# EAGLE design lcd_thermistor_two (EAGLE 6.0)
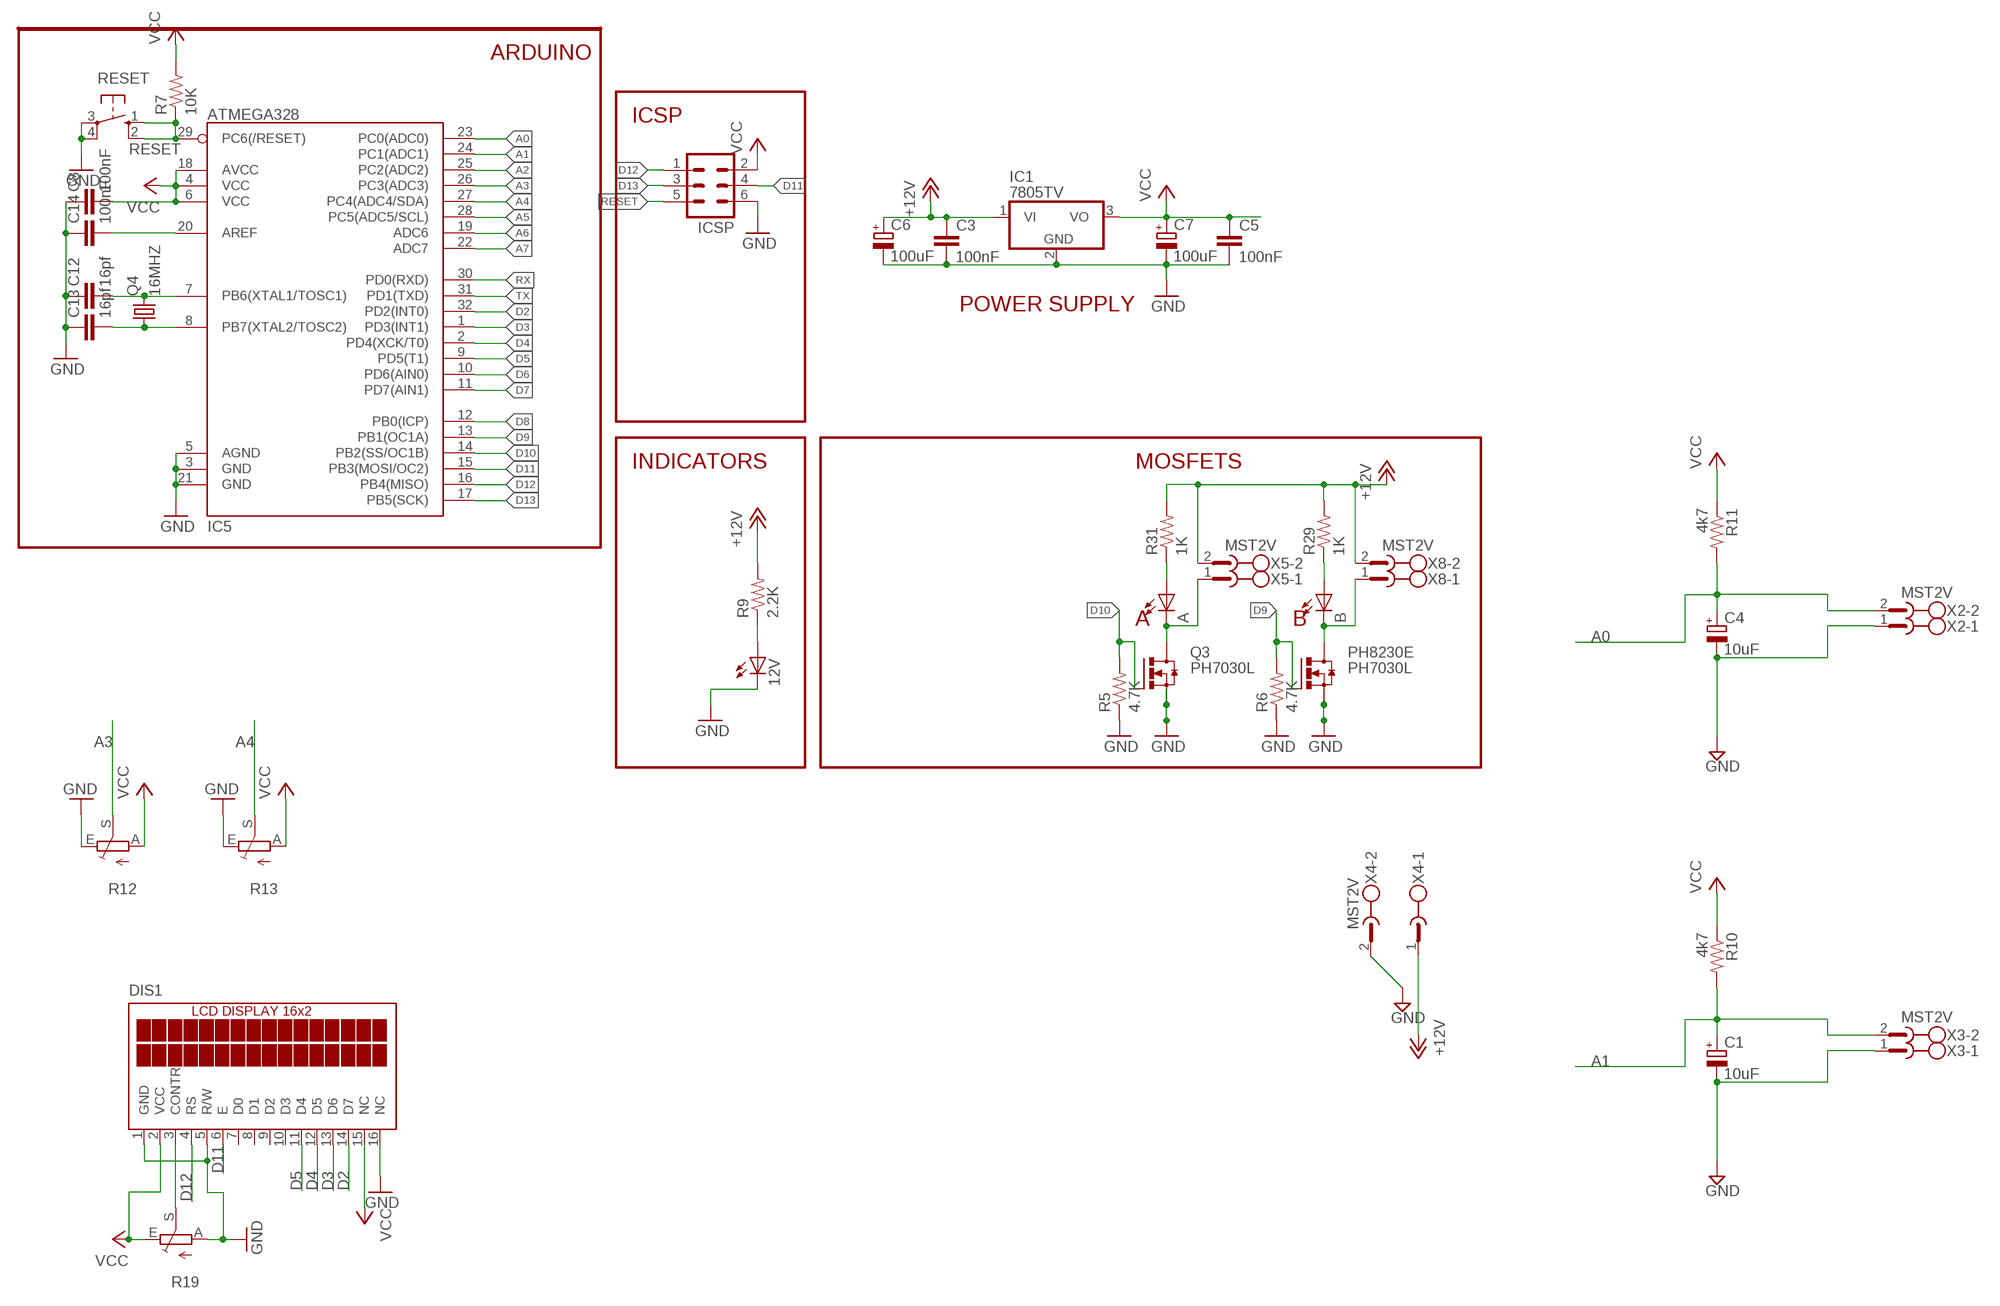
[diagram p0: schematic, sheet 1]

## Parts
12V  LED0805  [LED-0805]
A  LED0805  [LED-0805]
B  LED0805  [LED-0805]
C1  10uF  CPOL-EUE5-6  [E5-6]
C3  100nF  CAP0805  [0805]
C4  10uF  CPOL-EUE5-6  [E5-6]
C5  100nF  CAP0805  [0805]
C6  100uF  CPOL-EUE3.5-8  [E3,5-8]
C7  100uF  CPOL-EUE3.5-8  [E3,5-8]
C8  100nF  CAP0805  [0805]
C12  16pf  CAP0805  [0805]
C13  16pf  CAP0805  [0805]
C14  100nF  CAP0805  [0805]
DIS1  TUXGR_16X2_R2  [TUXGR_16X2_R2]
IC1  7805TV  [TO220V]
IC5  ATMEGA328  ATMEGA168  [TQFP32-08]
ICSP  ML6  [ML6]
PH8230E  PH7030L  [SOT669]
Q3  PH7030L  [SOT669]
Q4  16MHZ  CRYSTALHC49S  [HC49/S]
R5  4.7K  RESISTOR  [0805]
R6  4.7K  RESISTOR  [0805]
R7  10K  RESISTOR  [0805]
R9  2.2K  RESISTOR  [0805]
R10  4k7  RESISTOR  [0805]
R11  4k7  RESISTOR  [0805]
R12  TRIM_EU-B25U  [B25U]
R13  TRIM_EU-B25U  [B25U]
R19  TRIM_EU-B25P  [B25P]
R29  1K  RESISTOR  [0805]
R31  1K  RESISTOR  [0805]
RESET  10-XX  [B3F-10XX]
X2  MST2V  [MSTBV2]
X3  MST2V  [MSTBV2]
X4  MST2V  [MSTBV2]
X5  MST2V  [MSTBV2]
X8  MST2V  [MSTBV2]

## Nets
+12V [motors]: C3.1 C6.+ IC1.1(VI) R9.2 R29.2 R31.2 X4.1 X5.2 X8.2
A0: C4.+ IC5.23(PC0(ADC0)) R11.2 X2.2
A1: C1.+ IC5.24(PC1(ADC1)) R10.2 X3.2
A2: IC5.25(PC2(ADC2))
A3: IC5.26(PC3(ADC3)) R12.S
A4: IC5.27(PC4(ADC4/SDA)) R13.S
A5: IC5.28(PC5(ADC5/SCL))
A6: IC5.19(ADC6)
A7: IC5.22(ADC7)
APWR [motors]: A.C Q3.MB(D) X5.1
BPWR [motors]: B.C PH8230E.MB(D) X8.1
D2: DIS1.14(D7) IC5.32(PD2(INT0))
D3: DIS1.13(D6) IC5.1(PD3(INT1))
D4: DIS1.12(D5) IC5.2(PD4(XCK/T0))
D5: DIS1.11(D4) IC5.9(PD5(T1))
D6: IC5.10(PD6(AIN0))
D7: IC5.11(PD7(AIN1))
D8: IC5.12(PB0(ICP))
D9: IC5.13(PB1(OC1A)) PH8230E.4(G) R6.2
D10: IC5.14(PB2(SS/OC1B)) Q3.4(G) R5.2
D11: DIS1.6(E) IC5.15(PB3(MOSI/OC2)) ICSP.4
D12: DIS1.4(RS) IC5.16(PB4(MISO)) ICSP.1
D13: IC5.17(PB5(SCK)) ICSP.3
GND [motors]: 12V.C C1.- C3.2 C4.- C5.2 C6.- C7.- C8.1 C12.1 C13.1 C14.1 DIS1.1(GND) DIS1.5(R/W) DIS1.16(NC) IC1.2(GND) IC5.3(GND) IC5.5(AGND) IC5.21(GND) ICSP.6 PH8230E.1(S) PH8230E.2(S) PH8230E.3(S) Q3.1(S) Q3.2(S) Q3.3(S) R5.1 R6.1 R12.E R13.E R19.A RESET.3(P) RESET.4(P1) X2.1 X3.1 X4.2
N$20: C14.2 IC5.20(AREF)
N$26: 12V.A R9.1
N$29: DIS1.3(CONTR) R19.S
N$31: C12.2 IC5.7(PB6(XTAL1/TOSC1)) Q4.2
N$32: C13.2 IC5.8(PB7(XTAL2/TOSC2)) Q4.1
N$41: A.A R31.1
N$42: B.A R29.1
RESET: IC5.29(PC6(/RESET)) ICSP.5 R7.1 RESET.1(S) RESET.2(S1)
RX: IC5.30(PD0(RXD))
TX: IC5.31(PD1(TXD))
VCC: C5.1 C7.+ C8.2 DIS1.2(VCC) DIS1.15(NC) IC1.3(VO) IC5.4(VCC) IC5.6(VCC) IC5.18(AVCC) ICSP.2 R7.2 R10.1 R11.1 R12.A R13.A R19.E
Unconnected: DIS1.7(D0) DIS1.8(D1) DIS1.9(D2) DIS1.10(D3)

## Notes on the sheet
- ARDUINO
- ICSP
- POWER SUPPLY
- INDICATORS | MOSFETS
- A | B

## Library data of the parts
12V A B = SparkFun:LED: LEDs Standard schematic elements and footprints for 5mm, 3mm, 1206, and 0603 sized LEDs. 5mm - Spark Fun Electronics SKU : COM-00529 (and others)
C1 C4 C6 C7 = rcl:CPOL-EU: POLARIZED CAPACITOR, European symbol
C3 C5 C8 C12-C14 = SparkFun:CAP: Capacitor Standard 0603 ceramic capacitor, and 0.1" leaded capacitor.
DIS1 = display-lcd:TUXGR_16X2_R2: Tuxgraphics LCD display 16x2 characters reflective, without background light Source: tuxgr_12x2_r2.pdf
IC1 = linear:78*: Positive VOLTAGE REGULATOR Source: http://cache.national.com/ds/LM/LM78L05.pdf http://www.fairchildsemi.com/ds/LM/LM7805.pdf
IC5 = SparkFun:ATMEGA168
ICSP = con-harting-ml:ML6: HARTING
PH8230E Q3 = transistor-power:PH7030L: N-channel TrenchMOS (TM) logic level FET Source: http://www.nxp.com/acrobat_download/datasheets/PH7030L_4.pdf
Q4 = crystal:CRYSTAL: CRYSTAL
R5-R7 R9-R11 R29 R31 = SparkFun:RESISTOR: Resistor Basic schematic elements and footprints for 0603, 1206, and PTH 1/10th watt (small) resistors.
R12 R13 R19 = pot:TRIM_EU-: POTENTIOMETER
RESET = switch-omron:10-XX: OMRON SWITCH
X2-X5 X8 = con-phoenix-508:MST2V: PHOENIX

## Net classes
0 default: width 0.254 mm, clearance 0.254 mm
1 vcc: width 0.305 mm
2 motors: width 1.016 mm

## Board
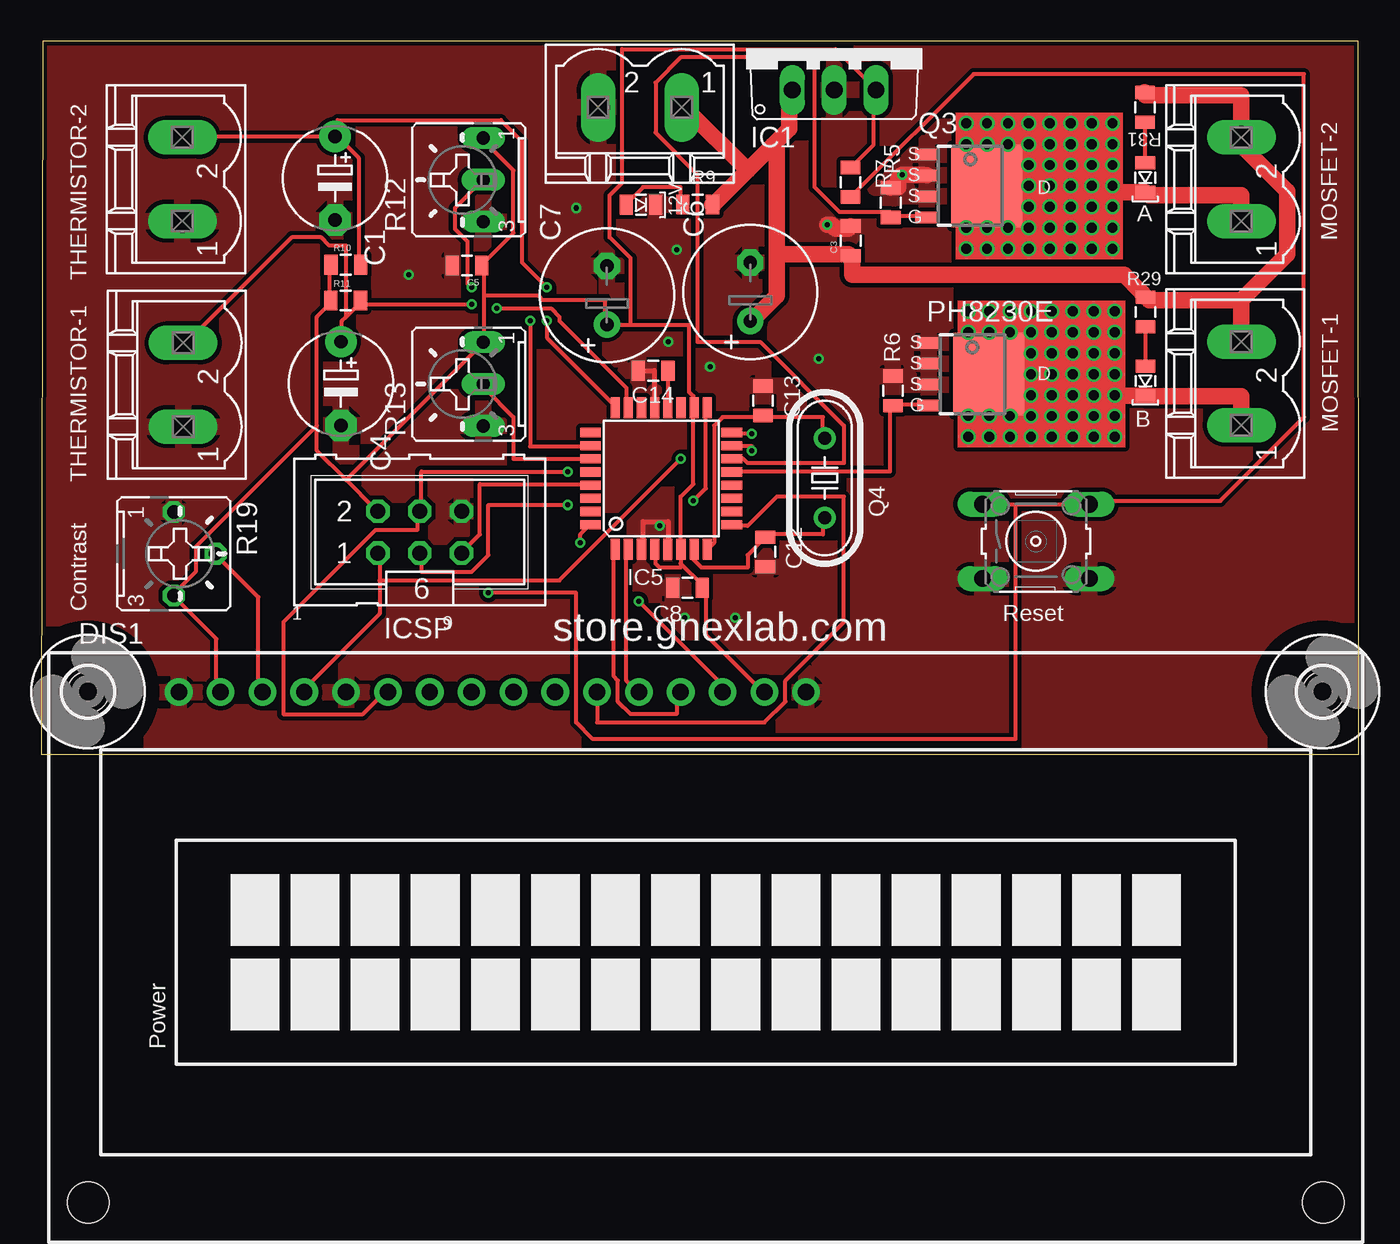
[diagram p1: board, top side]
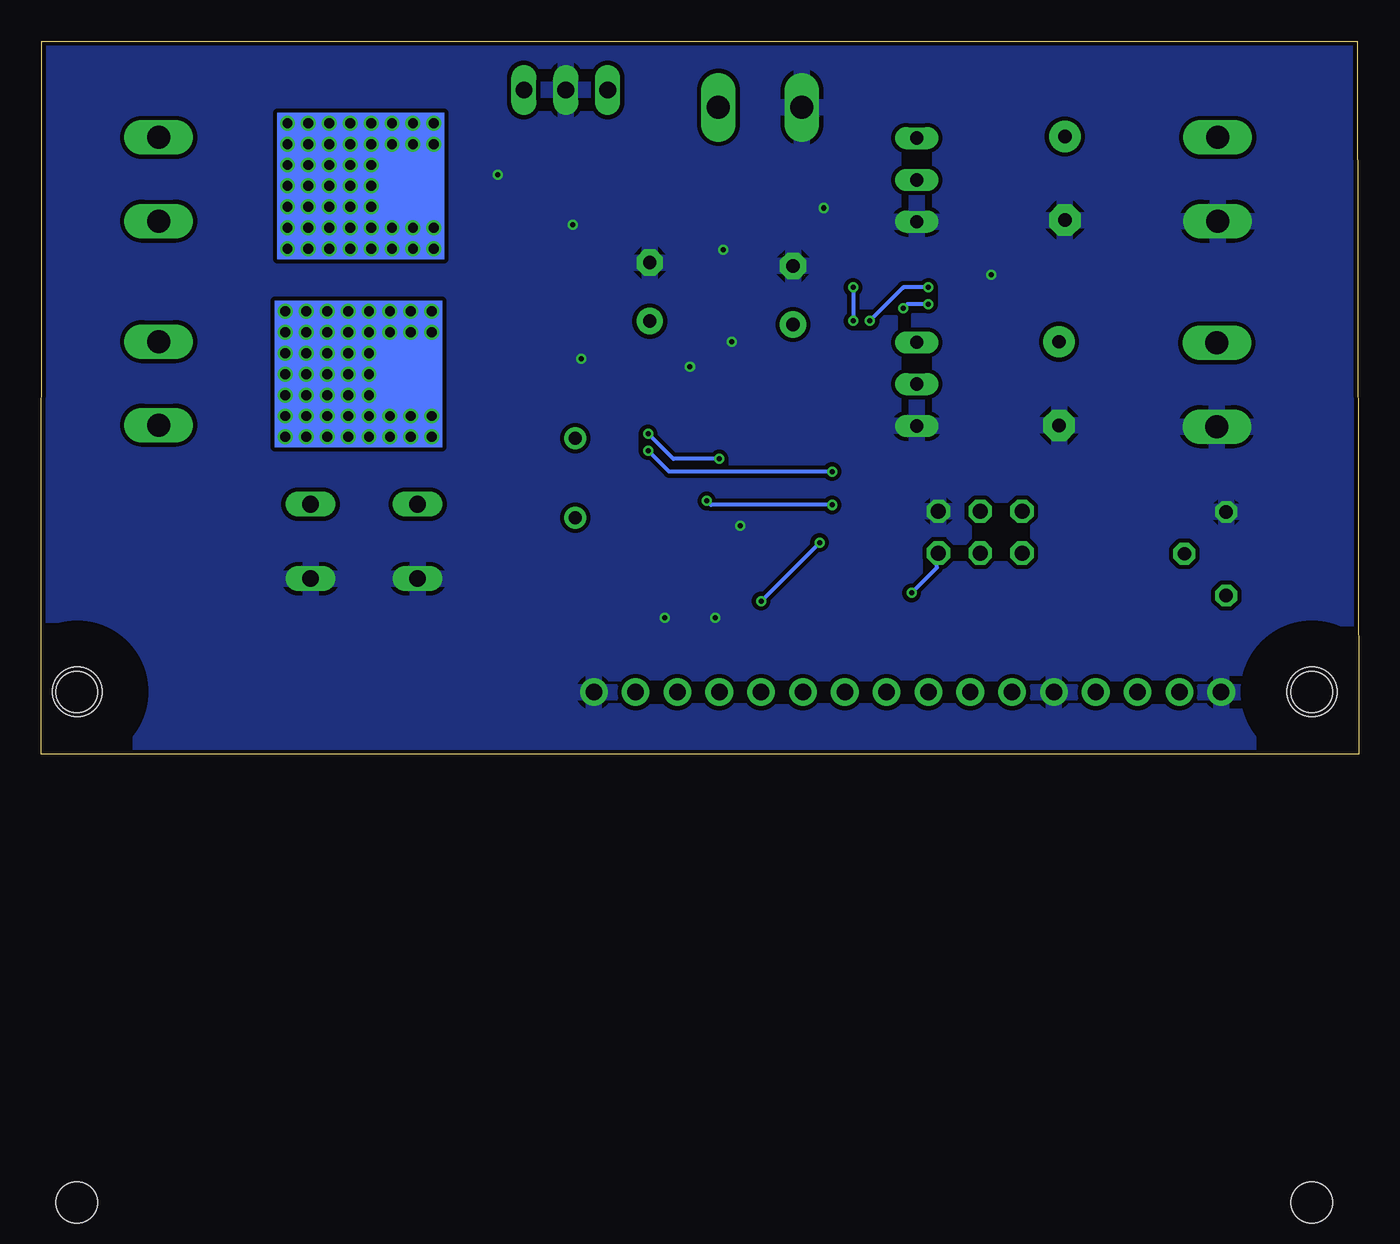
[diagram p2: board, bottom side, seen from below]

Size 80.01 x 43.29 mm. Coordinates in mm from the lower left corner, seen from the top.
Outline: 0,0 80.01,0 79.98,43.29 0.09,43.29 0,0
Copper layers (1*16): Top 0.035mm / dielectric 1.5mm / Bottom 0.035mm
Design rules: minimum track width 6mil, minimum drill 12mil, track to track 6mil, track to pad 6mil, pad to pad 6mil, via to via 6mil, smd to smd 0mil, copper to edge 10mil, drill to drill 10mil, minimum pad ring 10mil, minimum via ring 6mil, stop-mask expansion 2mil, vias tented up to drill 100mil, thermal gap 10mil

### Footprints (pad centres in the part's own frame; a part is rotated, then mirrored left to right if it is on the bottom)
LED-0805 = smd 1.2 x 0.8: A 0,-0.9; C 0,0.9
E5-6 = drill 0.813 pad 1.905: + -2.54,0 | drill 0.813 pad 1.905 octagon: - 2.54,0
0805 = smd 0.8 x 1.2: 1 -0.9,0; 2 0.9,0
E3,5-8 = drill 0.813 pad 1.6: + -1.778,0 | drill 0.813 pad 1.6 octagon: - 1.778,0
TUXGR_16X2_R2 = drill 1 pad 1.676: 1 -32,15.5; 2 -29.46,15.5; 3 -26.92,15.5; 4 -24.38,15.5; 5 -21.84,15.5; 6 -19.3,15.5; 7 -16.76,15.5; 8 -14.22,15.5; 9 -11.68,15.5; 10 -9.14,15.5; 11 -6.6,15.5; 12 -4.06,15.5; 13 -1.52,15.5; 14 1.02,15.5; 15 3.56,15.5; 16 6.1,15.5 | hole 2.5: -37.5,-15.5; 37.5,-15.5; -37.5,15.5; 37.5,15.5
TO220V = drill 1.016 long: 1 -2.54,-2.54; 2 0,-2.54; 3 2.54,-2.54
TQFP32-08 = smd 1.27 x 0.559: 1 -4.293,2.8; 2 -4.293,2; 3 -4.293,1.2; 4 -4.293,0.4; 5 -4.293,-0.4; 6 -4.293,-1.2; 7 -4.293,-2; 8 -4.293,-2.8; 17 4.293,-2.8; 18 4.293,-2; 19 4.293,-1.2; 20 4.293,-0.4; 21 4.293,0.4; 22 4.293,1.2; 23 4.293,2; 24 4.293,2.8 | smd 0.559 x 1.27: 9 -2.8,-4.293; 10 -2,-4.293; 11 -1.2,-4.293; 12 -0.4,-4.293; 13 0.4,-4.293; 14 1.2,-4.293; 15 2,-4.293; 16 2.8,-4.293; 25 2.8,4.293; 26 2,4.293; 27 1.2,4.293; 28 0.4,4.293; 29 -0.4,4.293; 30 -1.2,4.293; 31 -2,4.293; 32 -2.8,4.293
ML6 = drill 0.914 octagon: 1 -2.54,-1.27; 2 -2.54,1.27; 3 0,-1.27; 4 0,1.27; 5 2.54,-1.27; 6 2.54,1.27
SOT669 = smd 0.7 x 1.4: 1 -1.905,-2.65; 2 -0.635,-2.65; 3 0.635,-2.65; 4 1.905,-2.65 | smd 5 x 4.3: MB 0,1
HC49/S = drill 0.813: 1 -2.413,0; 2 2.413,0
B25U = drill 0.813 long: A 2.54,-0.889; E -2.54,-0.889; S 0,-0.889
B25P = drill 0.813 octagon: A -2.54,0; E 2.54,0; S 0,2.54
B3F-10XX = drill 1.016 long: 1 -3.251,2.261; 2 3.251,2.261; 3 -3.251,-2.261; 4 3.251,-2.261
3,0 = hole 3: 0,0
MSTBV2 = drill 1.397 long: 1 -2.54,0; 2 2.54,0

### Placement (x,y rotation side)
12V  36.42,33.36 270 top
A  67.04,35.01 180 top
B  67.06,22.66 180 top
C1  17.85,34.96 270 top
C3  49.16,31.17 90 top
C4  18.2,22.5 270 top
C5  25.86,29.67 180 top
C6  43.06,28.07 90 top
C7  34.36,27.87 90 top
C8  39.25,10.11 0 top
C12  43.97,12.28 90 top
C13  43.84,21.46 270 top
C14  37.16,23.28 0 top
DIS1  40.36,-11.73 0 top
IC1  48.16,42.87 0 top
IC5  37.65,16.73 90 top
ICSP  22.99,13.48 0 top
PH8230E  56.55,23.07 270 top
Q3  56.42,34.5 270 top
Q4  47.58,16.77 270 top
R5  51.6,33.49 270 top
R6  51.72,22.06 270 top
R7  49.15,34.73 90 top
R9  39.87,33.37 0 top
R10  18.5,29.71 0 top
R11  18.49,27.54 0 top
R12  25.96,34.87 90 top
R13  25.96,22.47 90 top
R19  8.06,12.17 270 top
R29  67.06,26.85 90 top
R31  67.02,39.28 90 top
RESET  60.41,12.92 0 top
U$1  [3,0]  2.84,3.79 0 top
U$4  [3,0]  77.82,3.79 0 top
X2  8.62,22.43 90 top
X3  8.57,34.91 90 top
X4  36.36,39.27 180 top
X5  72.88,34.91 90 top
X8  72.88,22.51 90 top

### Tracks (layer width: path | path; a pad name or v marks a point on that pad's centre or on a via)
+12V
  Top 1.016: 72.87,27.57 67.29,27.57 R29.2 66.78,28.08 65.76,29.1 49.25,29.1 49.25,29.86 C3.1 49,30.37 44.68,30.37 | 72.87,27.57 72.87,25.29 X8.2 | R31.2 67.03,40.02 72.87,40.02 72.87,37.48 X5.2 72.87,36.97 75.67,34.18 75.67,30.37 72.87,27.57 | 44.43,36.97 45.44,37.99 45.44,40.27 IC1.1 | 44.43,36.97 42.9,35.45 | 42.9,35.45 40.87,33.42 R9.2 | 44.68,30.37 44.68,36.72 44.43,36.97 | 44.68,30.37 44.68,27.83 43.16,26.3 C6.+ | 42.9,35.45 39.09,39.26 X4.1
A0  (via drill 0.3)
  Top 0.254: 18.52,26.56 18.26,26.3 18.26,25.29 C4.+ | 18.52,26.56 19.28,27.32 R11.2 19.53,27.32 v26.14,27.32 | v27.66,27.07 30.96,27.07 31.47,26.56 31.47,26.3 35.54,22.24 35.54,21.22 IC5.23 | 18.52,26.56 18.52,30.88 17.5,30.88 16.99,31.38 15.22,31.38 8.87,25.03 X2.2
  Bottom 0.254: v27.66,27.07 27.41,27.32 v26.14,27.32
A1  (via drill 0.3)
  Top 0.254: R10.2 19.28,29.86 19.28,36.21 18.01,37.48 C1.+ | v30.71,26.3 30.71,25.29 34.77,21.22 IC5.24 | v30.71,28.34 29.19,29.86 29.19,37.23 27.92,38.5 18.01,38.5 18.01,37.73 C1.+ | X3.2 8.61,37.48 17.76,37.48 C1.+
  Bottom 0.254: v30.71,28.34 v30.71,26.3
A3  (via drill 0.3)
  Top 0.254: v29.69,26.3 29.69,18.68 33.25,18.68 IC5.26 | v26.14,28.34 25.88,28.59 25.88,31.13 25.12,31.89 25.12,33.16 26.65,34.69 R12.S
  Bottom 0.254: v29.69,26.3 27.66,28.34 v26.14,28.34
A4
  Top 0.254: IC5.27 33.25,17.92 28.68,17.92 28.68,20.46 26.9,22.24 R13.S
APWR
  Top 1.016: X5.1 72.87,32.4 72.87,33.92 67.29,33.92 A.C 57.42,34.11 Q3.MB
BPWR
  Top 1.016: X8.1 72.87,20.21 72.87,21.73 67.29,21.73 B.C 57.55,21.76 PH8230E.MB
D2  (via drill 0.3)
  Top 0.254: v32.74,12.84 32.74,13.35 33.25,13.86 IC5.32 | v36.3,9.29 41.12,4.46 41.12,3.95 DIS1.14
  Bottom 0.254: v36.3,9.29 v32.74,12.84
D3
  Top 0.254: IC5.1 34.77,12.33 34.77,4.71 35.03,4.46 35.03,3.19 35.79,2.43 38.58,2.43 38.58,3.7 DIS1.13
D4
  Top 0.254: IC5.2 35.54,12.33 35.54,4.46 36.04,3.95 DIS1.12
D5
  Top 0.254: IC5.9 42.14,13.86 42.9,13.86 44.68,15.64 48.74,15.64 48.74,8.02 45.19,4.46 45.19,3.19 43.92,1.92 33.76,1.92 33.76,3.7 DIS1.11
D9
  Top 0.254: PH8230E.4 53.82,21.22 51.79,21.22 R6.2 51.54,20.97 51.54,17.16 42.14,17.16 IC5.13
D10
  Top 0.254: Q3.4 53.57,32.65 51.79,32.65 R5.2 51.54,32.65 51.54,32.91 48.49,32.91 46.97,34.43 46.97,42.31 38.84,42.31 37.31,40.78 37.31,37.73 39.85,35.19 39.85,25.03 43.66,25.03 48.74,19.95 48.74,17.67 42.9,17.67 42.65,17.92 42.14,17.92 IC5.14
D11  (via drill 0.3)
  Top 0.254: v43.16,18.43 43.16,18.68 42.14,18.68 IC5.15 | v31.98,17.16 23.09,17.16 23.09,14.87 ICSP.4 22.84,14.62 22.84,13.6 20.3,13.6 14.71,8.02 14.71,2.43 19.53,2.43 20.8,3.7 DIS1.6
  Bottom 0.254: v43.16,18.43 41.89,17.16 v31.98,17.16
D12  (via drill 0.3)
  Top 0.254: v43.16,19.45 42.14,19.45 IC5.16 | v38.84,17.92 31.47,10.56 20.55,10.56 | 20.55,10.56 20.55,12.08 ICSP.1 | 20.55,10.56 20.55,8.52 15.98,3.95 DIS1.4
  Bottom 0.254: v43.16,19.45 41.63,17.92 v38.84,17.92
D13  (via drill 0.3)
  Top 0.254: v39.6,15.38 40.36,16.14 40.36,20.97 IC5.17 | v31.98,15.13 27.15,15.13 27.15,12.08 26.14,11.06 23.09,11.06 23.09,12.08 ICSP.3
  Bottom 0.254: v39.6,15.38 39.35,15.13 v31.98,15.13
GND  (via drill 0.3)
  Top 0.305: IC5.3 36.55,12.44 36.55,14.11 38.08,14.11 38.08,12.44 | 38.08,12.44 38.08,12.33 | C14.1 37.24,23.28 37.24,21.02 | 37.24,21.02 37.31,20.97 | IC5.5 38.08,12.44 | IC5.21 37.24,21.02
  Top 1.016: R5.1 51.79,34.43 52.05,34.43 52.05,34.94 v52.3,35.19 53.57,35.19 Q3.2 | v47.73,32.15 47.98,32.15 48.24,31.89 49,31.89 C3.2
  other vias: 37.57,13.86 39.09,8.27 42.14,8.27 47.22,24.02 40.62,23.51 38.58,30.62 32.49,33.16 22.33,29.1 38.08,25.03
  pour Top (isolate 0.254): -1.85,45.94 83.47,45.4 83.33,-7.61 -1.12,-7.07
  pour Bottom (isolate 0.254): -0.42,44.31 81.91,44.16 80.54,-4.03 -1.15,-4.31
N$10  (via drill 0.6 pad 0)
  other vias: 56.17,38.31
N$13  (via drill 0.6 pad 0)
  other vias: 57.44,38.31
N$14  (via drill 0.6 pad 0)
  other vias: 58.71,38.31
N$15  (via drill 0.6 pad 0)
  other vias: 59.98,38.31
N$16  (via drill 0.6 pad 0)
  other vias: 61.25,38.31
N$17  (via drill 0.6 pad 0)
  other vias: 62.52,38.31
N$19  (via drill 0.6 pad 0)
  other vias: 63.79,38.31
N$20
  Top 0.254: C14.2 38.08,23.26 38.08,21.22 IC5.20
N$21  (via drill 0.6 pad 0)
  other vias: 65.06,38.31
N$22  (via drill 0.6 pad 0)
  other vias: 65.06,37.04
N$24  (via drill 0.6 pad 0)
  other vias: 63.79,37.04
N$26
  Top 0.254: 12V.A 35.54,33.42 36.55,34.43 38.84,34.43 38.84,33.42 R9.1
N$27  (via drill 0.6 pad 0)
  other vias: 62.52,37.04
N$28  (via drill 0.6 pad 0)
  other vias: 61.25,37.04
N$29
  Top 0.254: R19.S 10.64,12.08 13.18,9.54 13.18,3.95 DIS1.3
N$31
  Top 0.254: Q4.2 47.47,14.11 47.47,13.35 44.17,13.35 C12.2 43.92,13.1 42.9,12.08 42.9,11.32 40.11,11.32 39.6,11.83 39.6,12.33 IC5.7
N$32
  Top 0.254: Q4.1 47.47,19.19 47.47,20.46 43.92,20.46 C13.2 43.66,20.46 41.38,20.46 40.87,19.95 40.87,12.84 40.62,12.59 IC5.8
N$33  (via drill 0.6 pad 0)
  other vias: 59.98,37.04
N$34  (via drill 0.6 pad 0)
  other vias: 58.71,37.04
N$35  (via drill 0.6 pad 0)
  other vias: 57.44,37.04
N$41
  Top 0.254: R31.1 67.03,38.24 67.03,35.96 A.A
N$42
  Top 0.254: B.A 67.03,23.76 67.03,25.8 R29.1
N$43  (via drill 0.6 pad 0)
  other vias: 56.17,37.04
N$54  (via drill 0.6 pad 0)
  other vias: 59.98,35.77
N$55  (via drill 0.6 pad 0)
  other vias: 61.25,35.77
N$56  (via drill 0.6 pad 0)
  other vias: 62.52,35.77
N$57  (via drill 0.6 pad 0)
  other vias: 63.79,35.77
N$58  (via drill 0.6 pad 0)
  other vias: 65.06,35.77
N$62  (via drill 0.6 pad 0)
  other vias: 59.98,34.5
N$63  (via drill 0.6 pad 0)
  other vias: 61.25,34.5
N$64  (via drill 0.6 pad 0)
  other vias: 62.52,34.5
N$65  (via drill 0.6 pad 0)
  other vias: 63.79,34.5
N$66  (via drill 0.6 pad 0)
  other vias: 65.06,34.5
N$70  (via drill 0.6 pad 0)
  other vias: 59.98,33.23
N$71  (via drill 0.6 pad 0)
  other vias: 61.25,33.23
N$72  (via drill 0.6 pad 0)
  other vias: 62.52,33.23
N$73  (via drill 0.6 pad 0)
  other vias: 63.79,33.23
N$74  (via drill 0.6 pad 0)
  other vias: 65.06,33.23
N$75  (via drill 0.6 pad 0)
  other vias: 65.06,31.96
N$76  (via drill 0.6 pad 0)
  other vias: 63.79,31.96
N$77  (via drill 0.6 pad 0)
  other vias: 62.52,31.96
N$78  (via drill 0.6 pad 0)
  other vias: 61.25,31.96
N$79  (via drill 0.6 pad 0)
  other vias: 59.98,31.96
N$80  (via drill 0.6 pad 0)
  other vias: 58.71,31.96
N$81  (via drill 0.6 pad 0)
  other vias: 57.44,31.96
N$82  (via drill 0.6 pad 0)
  other vias: 56.17,31.96
N$84  (via drill 0.6 pad 0)
  Top 0.61: v56.17,30.69 v57.44,30.69
N$85  (via drill 0.6 pad 0)
  other vias: 58.71,30.69
N$86  (via drill 0.6 pad 0)
  other vias: 59.98,30.69
N$87  (via drill 0.6 pad 0)
  other vias: 61.25,30.69
N$88  (via drill 0.6 pad 0)
  other vias: 62.52,30.69
N$89  (via drill 0.6 pad 0)
  other vias: 63.79,30.69
N$90  (via drill 0.6 pad 0)
  other vias: 65.06,30.69
N$91  (via drill 0.6 pad 0)
  other vias: 56.3,26.88
N$92  (via drill 0.6 pad 0)
  other vias: 57.57,26.88
N$93  (via drill 0.6 pad 0)
  other vias: 58.84,26.88
N$94  (via drill 0.6 pad 0)
  other vias: 60.11,26.88
N$95  (via drill 0.6 pad 0)
  other vias: 61.38,26.88
N$96  (via drill 0.6 pad 0)
  other vias: 62.65,26.88
N$97  (via drill 0.6 pad 0)
  other vias: 63.92,26.88
N$98  (via drill 0.6 pad 0)
  other vias: 65.19,26.88
N$99  (via drill 0.6 pad 0)
  other vias: 65.19,25.61
N$100  (via drill 0.6 pad 0)
  other vias: 63.92,25.61
N$101  (via drill 0.6 pad 0)
  other vias: 62.65,25.61
N$102  (via drill 0.6 pad 0)
  other vias: 61.38,25.61
N$103  (via drill 0.6 pad 0)
  other vias: 60.11,25.61
N$104  (via drill 0.6 pad 0)
  other vias: 58.84,25.61
N$105  (via drill 0.6 pad 0)
  other vias: 57.57,25.61
N$106  (via drill 0.6 pad 0)
  other vias: 56.3,25.61
N$110  (via drill 0.6 pad 0)
  other vias: 60.11,24.34
N$111  (via drill 0.6 pad 0)
  other vias: 61.38,24.34
N$112  (via drill 0.6 pad 0)
  other vias: 62.65,24.34
N$113  (via drill 0.6 pad 0)
  other vias: 63.92,24.34
N$114  (via drill 0.6 pad 0)
  other vias: 65.19,24.34
N$115  (via drill 0.6 pad 0)
  other vias: 65.19,23.07
N$116  (via drill 0.6 pad 0)
  other vias: 63.92,23.07
N$117  (via drill 0.6 pad 0)
  other vias: 62.65,23.07
N$118  (via drill 0.6 pad 0)
  other vias: 61.38,23.07
N$119  (via drill 0.6 pad 0)
  other vias: 60.11,23.07
N$126  (via drill 0.6 pad 0)
  other vias: 60.11,21.8
N$127  (via drill 0.6 pad 0)
  other vias: 61.38,21.8
N$128  (via drill 0.6 pad 0)
  other vias: 62.65,21.8
N$129  (via drill 0.6 pad 0)
  other vias: 63.92,21.8
N$130  (via drill 0.6 pad 0)
  other vias: 65.19,21.8
N$131  (via drill 0.6 pad 0)
  other vias: 56.3,20.53
N$132  (via drill 0.6 pad 0)
  other vias: 57.57,20.53
N$133  (via drill 0.6 pad 0)
  other vias: 58.84,20.53
N$134  (via drill 0.6 pad 0)
  other vias: 60.11,20.53
N$135  (via drill 0.6 pad 0)
  other vias: 61.38,20.53
N$136  (via drill 0.6 pad 0)
  other vias: 62.65,20.53
N$137  (via drill 0.6 pad 0)
  other vias: 63.92,20.53
N$138  (via drill 0.6 pad 0)
  other vias: 65.19,20.53
N$139  (via drill 0.6 pad 0)
  other vias: 65.19,19.26
N$140  (via drill 0.6 pad 0)
  other vias: 63.92,19.26
N$141  (via drill 0.6 pad 0)
  other vias: 62.65,19.26
N$142  (via drill 0.6 pad 0)
  other vias: 61.38,19.26
N$143  (via drill 0.6 pad 0)
  other vias: 60.11,19.26
N$144  (via drill 0.6 pad 0)
  other vias: 58.84,19.26
N$145  (via drill 0.6 pad 0)
  other vias: 57.57,19.26
N$146  (via drill 0.6 pad 0)
  other vias: 56.3,19.26
RESET  (via drill 0.3)
  Top 0.254: IC5.29 33.25,16.4 26.65,16.4 26.65,13.35 25.63,12.33 ICSP.5 | R7.1 49.25,33.92 56.62,41.29 76.68,41.29 76.68,20.46 71.6,15.38 63.73,15.38 RESET.2 63.48,15.13 59.16,15.13 | 59.16,15.13 57.38,15.13 RESET.1 | v27.15,9.79 32.49,9.79 32.49,1.92 33.5,0.9 59.16,0.9 59.16,15.13
  Bottom 0.254: v27.15,9.79 25.63,11.32 25.63,12.08 ICSP.5
VCC
  Top 0.254: 26.9,27.83 26.9,25.03 R13.A 26.65,24.78 18.52,16.65 | 26.9,27.83 26.9,29.61 C5.1 26.9,29.86 28.68,31.64 28.68,35.45 26.9,37.23 R12.A | DIS1.2 10.64,3.95 10.64,7 8.1,9.54 R19.E 8.1,9.79 9.37,11.06 9.37,12.59 16.74,19.95 | R10.1 17.5,29.61 17.5,27.57 R11.1 17.5,27.32 16.74,26.56 16.74,19.95 | 16.74,19.95 16.74,18.43 18.52,16.65 | 18.52,16.65 20.3,14.87 ICSP.2 | R7.2 49.25,35.7 50.52,36.97 50.52,40.27 IC1.3 50.52,40.53 48.24,42.81 35.28,42.81 35.28,34.69 34.52,33.92 34.52,31.38 35.79,30.11 35.79,26.05 | 38.84,11.57 40.11,10.3 C8.2 40.36,10.05 40.36,7.25 43.66,3.95 DIS1.15 | 38.84,11.57 38.84,12.33 IC5.6 38.84,12.59 38.84,15.64 39.6,16.4 39.6,20.97 IC5.18 39.6,21.22 39.6,21.73 39.35,21.99 39.35,26.05 35.79,26.05 | 38.84,11.57 38.84,11.32 37.57,11.32 37.31,11.57 37.31,12.33 IC5.4 | 35.79,26.05 34.52,26.05 C7.+ 34.27,26.3 34.27,27.57 30.46,27.57 30.2,27.83 26.9,27.83
(copper drawn outside any net)
  shapes: Bottom area x2, Top area x2

### Text on the board
tPlace: 1 | S | S | D | S | G | MOSFET-2 | THERMISTOR-2 | S | S | S | D | G | MOSFET-1 | THERMISTOR-1 | Contrast | 1 | Reset | 9 | store.gnexlab.com | Power